# Altium project Module1.PrjPcb
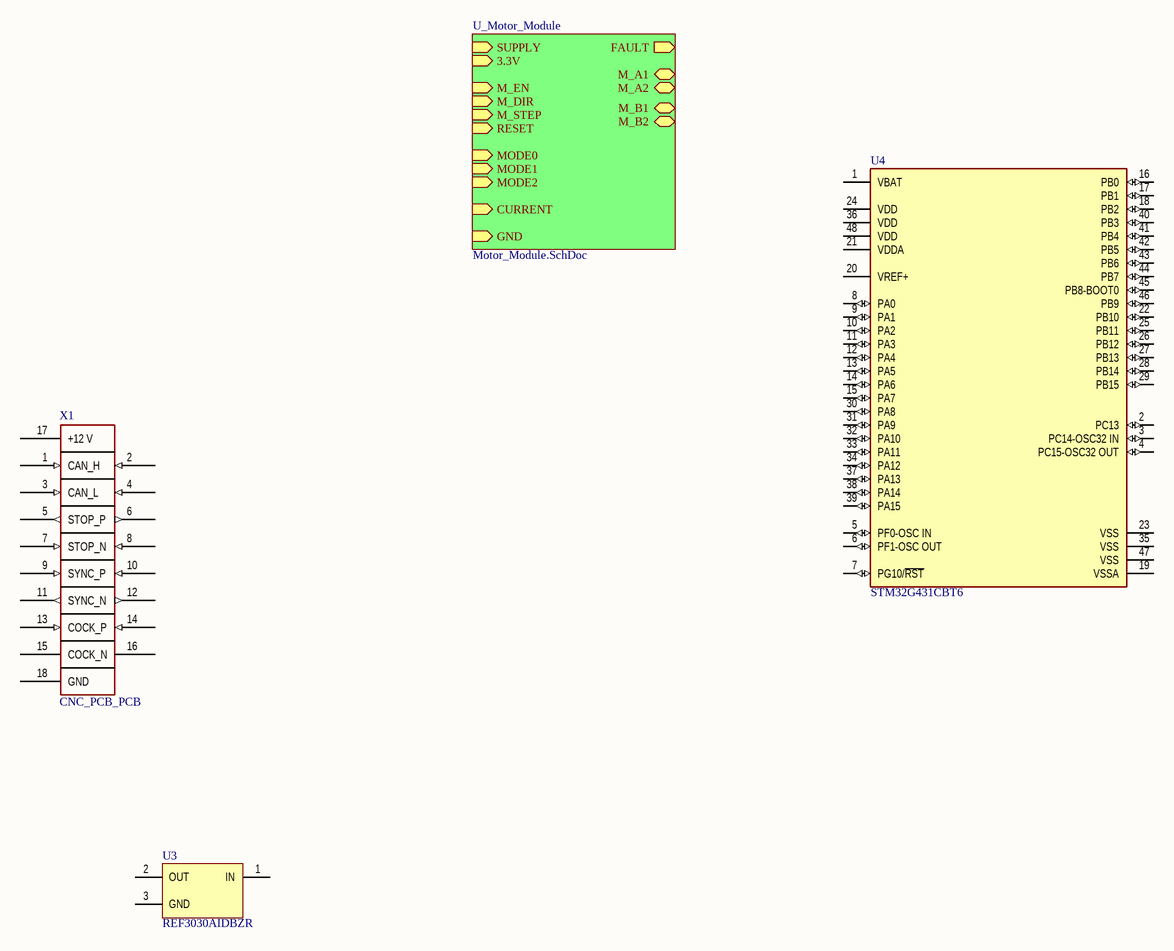
[diagram p0: Sheet1.SchDoc]
2 sheets, 24 parts. Net scope: hierarchical (ports join the sheet entries above them; power ports are global).
Board file: Module1.PcbDoc
Sheets:
  Sheet1.SchDoc
    U_Motor_Module = Motor_Module.SchDoc

## Sheet Sheet1.SchDoc: Название схемы
size 420 x 297 mm; ApprovedBy: Человек 1; CheckedBy: Человек 3; Author: Человек 2; DrawnBy: Человек; DocumentNumber: АЕСН.ХХХХХХ.ХХХЭ3; SheetNumber: x; SheetTotal: x; DocumentName: Sheet1.SCHDOC

### Parts
U3  REF3030AIDBZR  [DBZ0003A_N]
U4  STM32G431CBT6  [FP-LQFP48-5B-MFG]
X1  CNC_PCB_PCB  [CNC_PCB_PCB]

### Sub-sheets
U_Motor_Module = Motor_Module.SchDoc: M_A1 (bidir), M_A2 (bidir), M_B1 (bidir), M_B2 (bidir), M_EN (in), M_STEP (in), M_DIR (in), SUPPLY (in), GND (in), RESET (in), FAULT (out), MODE0 (in), MODE1 (in), MODE2 (in), CURRENT (in), 3.3V (in)

### Nets

Not connected (* = marked no-connect by the designer): U3 1(IN) 2(OUT) 3(GND); U4 1(VBAT) 2(PC13) 3(PC14-OSC32_IN) 4(PC15-OSC32_OUT) 5(PF0-OSC_IN) 6(PF1-OSC_OUT) 7(PG10/~{RST}) 8(PA0) 9(PA1) 10(PA2) 11(PA3) 12(PA4) 13(PA5) 14(PA6) 15(PA7) 16(PB0) 17(PB1) 18(PB2) 19(VSSA) 20(VREF+) 21(VDDA) 22(PB10) 23(VSS) 24(VDD) 25(PB11) 26(PB12) 27(PB13) 28(PB14) 29(PB15) 30(PA8) 31(PA9) 32(PA10) 33(PA11) 34(PA12) 35(VSS) 36(VDD) 37(PA13) 38(PA14) 39(PA15) 40(PB3) 41(PB4) 42(PB5) 43(PB6) 44(PB7) 45(PB8-BOOT0) 46(PB9) 47(VSS) 48(VDD); X1 1(CAN_H) 2(CAN_H) 3(CAN_L) 4(CAN_L) 5(STOP_P) 6(STOP_P) 7(STOP_N) 8(STOP_N) 9(SYNC_P) 10(SYNC_P) 11(SYNC_N) 12(SYNC_N) 13(COCK_P) 14(COCK_P) 15(COCK_N) 16(COCK_N) 17(+12_V) 18(GND)

### Notes on the sheet
- Перв.примен.
- Справ. №
- Подп. и дата
- Инв.№ дубл.
- Взам. инв. №
- Изм.
- Лист
- № докум.
- Подп.
- Дата
- Лит.
- Масса
- Масштаб
- Пров.
- Т.контр
- Разраб.
- Схема электрическая принципиальная
- 1
- Листов
- Инв № подл.
- Н.контр.
- Утв.
- Копировал
- Формат А3

### Library data of the parts
U3 = CMP-0367-00160-2: 2.048 V, 50 ppm / degC, 50 uA Series (Bandgap) Voltage Reference, -40 to 125 degC, 3-pin SOT-23 (DBZ), Green (RoHS & no Sb/Br); ComponentLink1URL: http://www.ti.com/; ComponentLink3URL: http://www.ti.com/litv/pdf/mpds108a; ComponentLink2URL: http://www.ti.com/general/docs/lit/getliterature.tsp?genericPartNumber=REF3020&fileType=pdf; ComponentLink3Description: Package Specification; ComponentLink4Description: URL Link1; ComponentLink2Description: Datasheet; ComponentLink4URL: Samples URL:http://www.ti.com/product/ref3020; ComponentLink1Description: Manufacturer URL; Model: REF3030AIDBZR; Type: IC
U4 = CMP-12105-000030-1: MAINSTREAM ARM CORTEX-M4+ MCU 17; Manufacturer: STMicroelectronics; Number Of Adc Channels: 17; Number Of I/Os: 38; Standoff Height: 0.05mm; Number Of Usb Channels: 1; Data Bus Width: 32bits; Number Of I2C Channels: 3; Number Of Pwm Channels: 31; Frequency: 170MHz; Memory Type: FLASH; Number Of Timers/Counters: 14; Ram Size: 32KBytes; Max Junction Temp: +105°C; Memory Size: 128KBytes; Min Supply Voltage: 1.62V; Description: ARM® Cortex®-M4F STM32G4 Microcontroller IC 32-Bit 170MHz 128KB (128K x 8) FLASH 48-LQFP (7x7); Max Supply Voltage: 3.6V; Number Of Uart Channels: 4; Interface: I2C,SPI,UART,USART,CAN,USB,LIN,IrDA,I2S; Temperature Range Low: -40°C; Lead Free: Yes; Device Class L3: Microcontrollers; Number Of Cores: 1; Temperature Range High: +85°C; Height: 1.6mm; Digikey Description: MAINSTREAM ARM CORTEX-M4+ MCU 17; Device Class L1: Integrated Circuits (ICs); Package: LQFP48-5B; RoHS: TRUE; Number Of A/D Converters: 1; Core Architecture: Arm Cortex-M4; Device Class L2: Embedded Processors and Controllers; ComponentLink2Description: Datasheet; Temperature: -40°C to +85°C; Ambient Temperature Range High: +85°C; Ambient Temperature Range Low: -40°C; Octopart: https://octopart.com/stm32g431cbt6-stmicroelectronics-98835224; ComponentLink2URL: https://www.st.com/resource/en/datasheet/stm32g431cb.pdf; Automotive: No; Number Of Spi Channels: 3; Manufacturer Part Number: STM32G431CBT6; Category: IC

## Sheet Motor_Module.SchDoc: Название схемы
size 420 x 297 mm; ApprovedBy: Человек 1; CheckedBy: Человек 3; Author: Человек 2; DrawnBy: Человек; DocumentNumber: АЕСН.ХХХХХХ.ХХХЭ3; SheetNumber: x; SheetTotal: x; DocumentName: Sheet1.SCHDOC
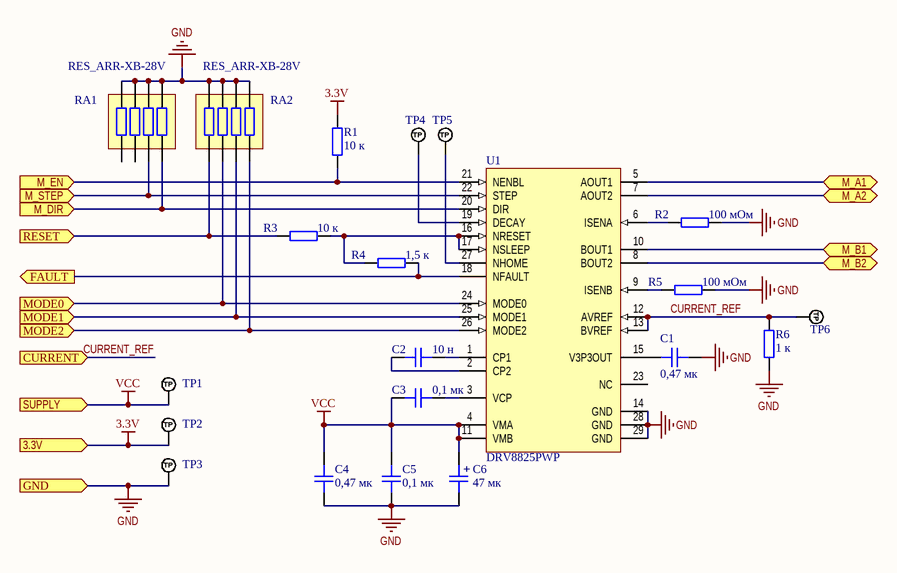
[diagram p1: Motor_Module.SchDoc]

### Parts
C1  0,47 мк  [CAP_0603]
C2  10 н  [CAP_0603]
C3  0,1 мк  [CAP_0603]
C4  0,47 мк  [CAP_0805]
C5  0,1 мк  [CAP_0805]
C6  47 мк  [CAP_AE_SMD_D6MM3_H5M55]
R1  10 к  [RES_0603]
R2  100 мОм  [RES_1206]
R3  10 к  [RES_0603]
R4  1,5 к  [RES_0603]
R5  100 мОм  [RES_1206]
R6  1 к  [RES_0603]
RA1  RES_ARR-XB-28V  [EXB-28V]
RA2  RES_ARR-XB-28V  [EXB-28V]
TP1  SUP  [PAD_RND_1MM]  (value not drawn)  (no BOM)
TP2  SUP  [PAD_RND_1MM]  (value not drawn)  (no BOM)
TP3  GND  [PAD_RND_1MM]  (value not drawn)  (no BOM)
TP4  DECAY  [PAD_RND_1MM]  (value not drawn)  (no BOM)
TP5  NHOME  [PAD_RND_1MM]  (value not drawn)  (no BOM)
TP6  CURRENT  [PAD_RND_1MM]  (value not drawn)  (no BOM)
U1  DRV8825PWP  [PWP0028C_L]

### Ports
3.3V (in), CURRENT (in), FAULT (out), GND (in), M_A1 (bidir), M_A2 (bidir), M_B1 (bidir), M_B2 (bidir), M_DIR (in), M_EN (in), M_STEP (in), MODE0 (in), MODE1 (in), MODE2 (in), RESET (in), SUPPLY (in)

### Nets
3.3V: R1.1 TP2.1(TP) ; port 3.3V
GND: C1.2 C4.2 C5.2 C6.2 R2.2 R5.2 R6.2 RA1.5 RA1.6 RA1.7 RA1.8 RA2.5 RA2.6 RA2.7 RA2.8 TP3.1(TP) U1.14(GND) U1.28(GND) U1.29(GND) ; port GND
VCC: C3.1 C4.1 C5.1 C6.1 TP1.1(TP) U1.4(VMA) U1.11(VMB) ; port SUPPLY
CURRENT_REF: R6.1 TP6.1(TP) U1.12(AVREF) U1.13(BVREF) ; port CURRENT
NetC1_1: C1.1 U1.15(V3P3OUT)
NetC2_1: C2.1 U1.1(CP1)
NetC2_2: C2.2 U1.2(CP2)
NetC3_2: C3.2 U1.3(VCP)
NetR1_2: R1.2 U1.21(NENBL) ; port M_EN
NetR2_1: R2.1 U1.6(ISENA)
NetR3_1: R3.1 R4.2 U1.16(NRESET) U1.17(NSLEEP)
NetR3_2: R3.2 RA2.1 ; port RESET
NetR4_1: R4.1 U1.18(NFAULT) ; port FAULT
NetR5_1: R5.1 U1.9(ISENB)
NetRA1_3: RA1.3 U1.22(STEP) ; port M_STEP
NetRA1_4: RA1.4 U1.20(DIR) ; port M_DIR
NetRA2_2: RA2.2 U1.24(MODE0) ; port MODE0
NetRA2_3: RA2.3 U1.25(MODE1) ; port MODE1
NetRA2_4: RA2.4 U1.26(MODE2) ; port MODE2
NetTP4_1: TP4.1(TP) U1.19(DECAY)
NetTP5_1: TP5.1(TP) U1.27(NHOME)
NetU1_5: U1.5(AOUT1) ; port M_A1
NetU1_7: U1.7(AOUT2) ; port M_A2
NetU1_8: U1.8(BOUT2) ; port M_B2
NetU1_10: U1.10(BOUT1) ; port M_B1

Not connected (* = marked no-connect by the designer): RA1 1 2; U1 23(NC)

### Notes on the sheet
- Подп. и дата
- Инв.№ дубл.
- Взам. инв. №
- Инв № подл.
- Изм.
- Лист
- № докум.
- Подп.
- Дата
- Копировал
- Формат А3
- (in symbol CAP_ALEL_6.3x5.5) +

### Library data of the parts
C1 C2 = CAP_0805: Capacitor SMD 0805; Type: CAP_CERAMIC
  C1: Rating: *; Dielectric: *; Value: 0,47 мк
  C2: Value: 10 н
C3-C5 = CAP_0805: Capacitor SMD 0805; Voltage: 50; Type: CAP_CERAMIC
  C3 C5: Value: 0,1 мк
  C4: Value: 0,47 мк
C6 = CAP_ALEL_6.3x5.5: Capacitor SMD Aluminium Electrolytic 6.3mm Diameter 5.5mm Height; ChipDip: 9000565731; Voltage: 50; Type: CAP_ELECTROLYTIC; Value: 47 мк
R1 R3 R4 R6 = RES_0805: Resistor SMD 0805; Type: RESISTOR
  R1 R3: Value: 10 к
  R4: Value: 1,5 к
  R6: Value: 1 к
R2 R5 = RES_1206: Resistor SMD 1206; Value: 100 мОм; Type: RESISTOR
RA1 RA2 = RES_ARR-XB-28V: Resistor Array 0402 4 Elements Panasonic EXB-28V; Manufacturer: Panasonic
TP1-TP6 = TEST_POINT_RND_1MM: Test Point Round 1mm (NO BOM); Type: *
  TP1 TP2: CustomTxt: SUP
  TP3: CustomTxt: GND
  TP4: CustomTxt: DECAY
  TP5: CustomTxt: NHOME
  TP6: CustomTxt: CURRENT
U1 = CMP-1685-00019-1: Stepper Motor Controller IC, 8.2 to 45 V, -40 to 85 degC, 28-Pin HTSSOP (PWP), Green (RoHS & no Sb/Br), Tube; ComponentLink2URL: http://www.ti.com/general/docs/lit/getliterature.tsp?genericPartNumber=DRV8825&fileType=pdf; ComponentLink2Description: Datasheet; ComponentLink1Description: Manufacturer URL; ComponentLink1URL: http://www.ti.com/; Model: DRV8825PWP; Type: IC